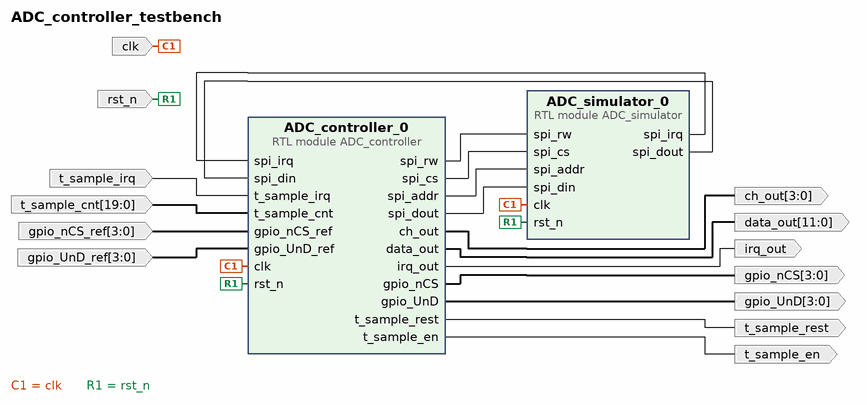
[diagram p0: block diagram of the top level]
# Vivado block design ADC_controller_testbench, xczu3eg-sbva484-1-i, Vivado 2020.2
create_bd_design ADC_controller_testbench

create_bd_port -dir I -type clk clk
create_bd_port -dir I -type rst rst_n
create_bd_port -dir O irq_out
create_bd_port -dir I t_sample_irq
create_bd_port -dir I -from 19 -to 0 t_sample_cnt
create_bd_port -dir O -from 3 -to 0 ch_out
create_bd_port -dir O t_sample_rest
create_bd_port -dir O -from 11 -to 0 data_out
create_bd_port -dir O t_sample_en
create_bd_port -dir I -from 3 -to 0 gpio_nCS_ref
create_bd_port -dir O -from 3 -to 0 gpio_nCS
create_bd_port -dir I -from 3 -to 0 gpio_UnD_ref
create_bd_port -dir O -from 3 -to 0 gpio_UnD

create_bd_cell -type module -reference ADC_controller ADC_controller_0
create_bd_cell -type module -reference ADC_simulator ADC_simulator_0

# ---- connections ----

connect_bd_net [get_bd_pins ADC_simulator_0/spi_irq] [get_bd_pins ADC_controller_0/spi_irq]
connect_bd_net -net clk_0_1 [get_bd_ports clk] [get_bd_pins ADC_simulator_0/clk] [get_bd_pins ADC_controller_0/clk]
connect_bd_net -net rst_n_0_1 [get_bd_ports rst_n] [get_bd_pins ADC_simulator_0/rst_n] [get_bd_pins ADC_controller_0/rst_n]
connect_bd_net [get_bd_pins ADC_controller_0/spi_rw] [get_bd_pins ADC_simulator_0/spi_rw]
connect_bd_net [get_bd_pins ADC_controller_0/spi_cs] [get_bd_pins ADC_simulator_0/spi_cs]
connect_bd_net [get_bd_pins ADC_controller_0/spi_addr] [get_bd_pins ADC_simulator_0/spi_addr]
connect_bd_net [get_bd_pins ADC_controller_0/spi_dout] [get_bd_pins ADC_simulator_0/spi_din]
connect_bd_net [get_bd_pins ADC_simulator_0/spi_dout] [get_bd_pins ADC_controller_0/spi_din]
connect_bd_net [get_bd_pins ADC_controller_0/irq_out] [get_bd_ports irq_out]
connect_bd_net -net t_sample_irq_0_1 [get_bd_ports t_sample_irq] [get_bd_pins ADC_controller_0/t_sample_irq]
connect_bd_net -net t_sample_cnt_0_1 [get_bd_ports t_sample_cnt] [get_bd_pins ADC_controller_0/t_sample_cnt]
connect_bd_net [get_bd_pins ADC_controller_0/ch_out] [get_bd_ports ch_out]
connect_bd_net [get_bd_pins ADC_controller_0/t_sample_rest] [get_bd_ports t_sample_rest]
connect_bd_net [get_bd_pins ADC_controller_0/data_out] [get_bd_ports data_out]
connect_bd_net [get_bd_pins ADC_controller_0/t_sample_en] [get_bd_ports t_sample_en]
connect_bd_net -net gpio_nCS_ref_0_1 [get_bd_ports gpio_nCS_ref] [get_bd_pins ADC_controller_0/gpio_nCS_ref]
connect_bd_net [get_bd_pins ADC_controller_0/gpio_nCS] [get_bd_ports gpio_nCS]
connect_bd_net -net gpio_UnD_ref_0_1 [get_bd_ports gpio_UnD_ref] [get_bd_pins ADC_controller_0/gpio_UnD_ref]
connect_bd_net [get_bd_pins ADC_controller_0/gpio_UnD] [get_bd_ports gpio_UnD]

validate_bd_design
save_bd_design
